# Altium project IOT_GRN_MAIN V1.0 A.PrjPcb (part 3 of 3)

## Sheet IOT_GRN_MAIN V1.0 A - OUTPUTS.SchDoc
size A4; SheetNumber: 4; SheetTotal: 4
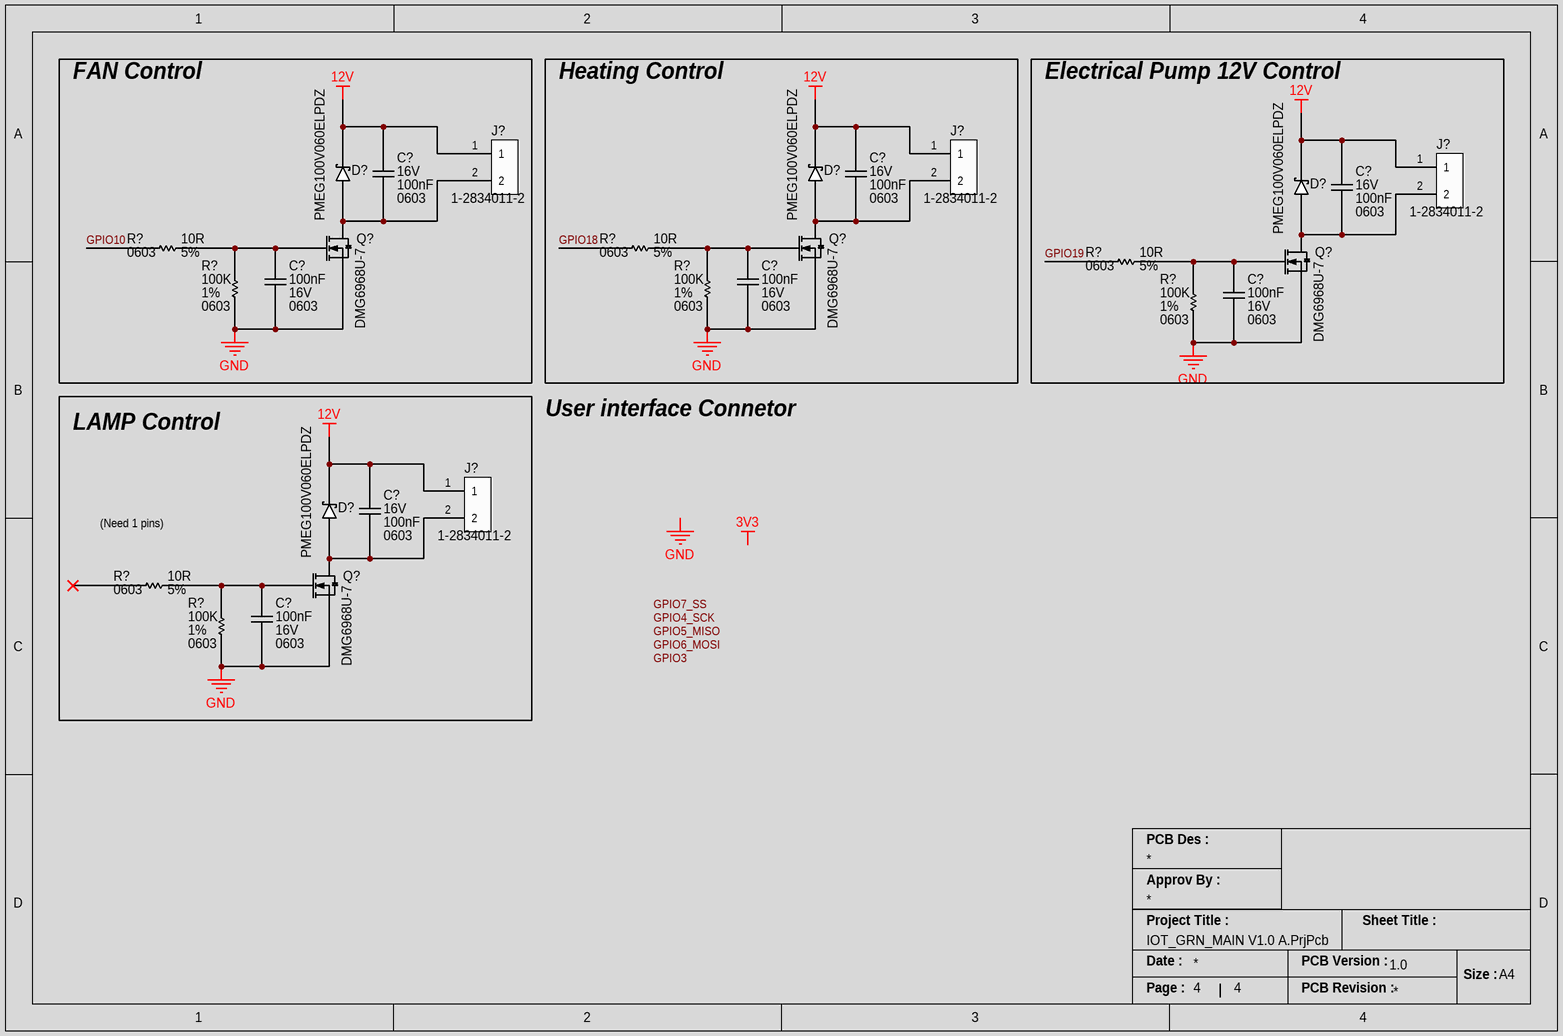
[diagram p3: IOT_GRN_MAIN V1.0 A - OUTPUTS.SchDoc]

### Parts
(Parts that share a designator on the sheet are numbered #1, #2 ... from top to bottom, then left to right.)
C?#9  Voltage: 16V  Capacitance: 100nF  Case/Package: 0603  [CAP_0603_CAPC1608X08N]  (hidden comment: CL10B104KO8NNNC)
C?#10  Voltage: 16V  Capacitance: 100nF  Case/Package: 0603  [CAP_0603_CAPC1608X08N]  (hidden comment: CL10B104KO8NNNC)
C?#11  Voltage: 16V  Capacitance: 100nF  Case/Package: 0603  [CAP_0603_CAPC1608X08N]  (hidden comment: CL10B104KO8NNNC)
C?#12  Voltage: 16V  Capacitance: 100nF  Case/Package: 0603  [CAP_0603_CAPC1608X08N]  (hidden comment: CL10B104KO8NNNC)
C?#13  Voltage: 16V  Capacitance: 100nF  Case/Package: 0603  [CAP_0603_CAPC1608X08N]  (hidden comment: CL10B104KO8NNNC)
C?#14  Voltage: 16V  Capacitance: 100nF  Case/Package: 0603  [CAP_0603_CAPC1608X08N]  (hidden comment: CL10B104KO8NNNC)
C?#15  Voltage: 16V  Capacitance: 100nF  Case/Package: 0603  [CAP_0603_CAPC1608X08N]  (hidden comment: CL10B104KO8NNNC)
C?#16  Voltage: 16V  Capacitance: 100nF  Case/Package: 0603  [CAP_0603_CAPC1608X08N]  (hidden comment: CL10B104KO8NNNC)
D?#5  PMEG100V060ELPDZ  [DIO_SCKTY_PMEG060V100EPDAZ]
D?#6  PMEG100V060ELPDZ  [DIO_SCKTY_PMEG060V100EPDAZ]
D?#7  PMEG100V060ELPDZ  [DIO_SCKTY_PMEG060V100EPDAZ]
D?#8  PMEG100V060ELPDZ  [DIO_SCKTY_PMEG060V100EPDAZ]
J?#4  1-2834011-2  [CONN_TBLOCK_128340112]
J?#5  1-2834011-2  [CONN_TBLOCK_128340112]
J?#6  1-2834011-2  [CONN_TBLOCK_128340112]
J?#7  1-2834011-2  [CONN_TBLOCK_128340112]
Q?#1  DMG6968U-7  [SOT_23_3_MMBT2907A-13]
Q?#2  DMG6968U-7  [SOT_23_3_MMBT2907A-13]
Q?#3  DMG6968U-7  [SOT_23_3_MMBT2907A-13]
Q?#4  DMG6968U-7  [SOT_23_3_MMBT2907A-13]
R?#2  Resistance: 10R  Tolerance: 5%  Case/Package: 0603  [RES_0603_RESC1608X04N]  (hidden comment: RC0603JR-0710RL)
R?#3  Resistance: 10R  Tolerance: 5%  Case/Package: 0603  [RES_0603_RESC1608X04N]  (hidden comment: RC0603JR-0710RL)
R?#4  Resistance: 10R  Tolerance: 5%  Case/Package: 0603  [RES_0603_RESC1608X04N]  (hidden comment: RC0603JR-0710RL)
R?#5  Resistance: 100K  Tolerance: 1%  Case/Package: 0603  [RES_0603_RESC1608X04N]  (hidden comment: RC0603FR-07100KL)
R?#6  Resistance: 100K  Tolerance: 1%  Case/Package: 0603  [RES_0603_RESC1608X04N]  (hidden comment: RC0603FR-07100KL)
R?#7  Resistance: 100K  Tolerance: 1%  Case/Package: 0603  [RES_0603_RESC1608X04N]  (hidden comment: RC0603FR-07100KL)
R?#8  Resistance: 10R  Tolerance: 5%  Case/Package: 0603  [RES_0603_RESC1608X04N]  (hidden comment: RC0603JR-0710RL)
R?#9  Resistance: 100K  Tolerance: 1%  Case/Package: 0603  [RES_0603_RESC1608X04N]  (hidden comment: RC0603FR-07100KL)

### Nets
12V: C?#9.2 C?#10.2 C?#11.2 C?#15.2 D?#5.K D?#6.K D?#7.K D?#8.K J?#4.1 J?#5.1 J?#6.1 J?#7.1
GND: C?#12.1 C?#13.1 C?#14.1 C?#16.1 Q?#1.S Q?#2.S Q?#3.S Q?#4.S R?#5.1 R?#6.1 R?#7.1 R?#9.1
GPIO10: R?#2.1
GPIO18: R?#3.1
GPIO19: R?#4.1
NetC?#9_1: C?#9.1 D?#5.A J?#4.2 Q?#1.D
NetC?#10_1: C?#10.1 D?#6.A J?#5.2 Q?#2.D
NetC?#11_1: C?#11.1 D?#7.A J?#6.2 Q?#3.D
NetC?#12_2: C?#12.2 Q?#1.G R?#2.2 R?#5.2
NetC?#13_2: C?#13.2 Q?#2.G R?#3.2 R?#6.2
NetC?#14_2: C?#14.2 Q?#3.G R?#4.2 R?#7.2
NetC?#15_1: C?#15.1 D?#8.A J?#7.2 Q?#4.D
NetC?#16_2: C?#16.2 Q?#4.G R?#8.2 R?#9.2

Not connected (* = marked no-connect by the designer): R?#8 1*

### Notes on the sheet
- FAN Control
- Heating Control
- Electrical Pump 12V Control
- LAMP Control
- User interface Connetor
- (Need 1 pins)
- Labels drawn without touching a wire or pin: 3V3, GND, GPIO3, GPIO4_SCK, GPIO5_MISO, GPIO6_MOSI, GPIO7_SS
- PCB Des :
- Approv By :
- Project Title :
- Sheet Title :
- Date :
- PCB Version :
- Size :
- A4
- Page :
- PCB Revision :

### Library data of the parts
C?#9-C?#16 = CAP_100NF_16V_X7R_0603: Ceramic capacitor SMD-0603 100nF /16V X7R# K +-10%, Samsung, RoHS; Dielectric: X7R; Tolerance: 10%; Manufacturer: Samsung; Manufacturer Part Number: CL10B104KO8NNNC; RoHS: Yes; Category: Ceramic Capacitors; Stock 1: 9799745; Pricing 1: 1=0.10000, 10=0.02700, 50=0.01500, 100=0.01220, 500=0.00874, 1000=0.00686 (USD); Mount: Surface Mount; Case Code (Metric): 1608; Case Code (Imperial): 0603; Material: Ceramic; Contact Plating: Tin; Min Operating Temperature: -55°C; Max Operating Temperature: 125°C; Packaging: Tape and Reel; Package Quantity: 1; Voltage Rating: 16V; Series: CL; Length: 1.6mm; Width: 0.031inch; Height: 0.8mm; Depth: 0.8mm; Thickness: 0.035inch; Radiation Hardening: No; Lead Free: Lead Free; RoHS Compliant: Yes; ComponentLink1URL: https://datasheet.ciiva.com/25805/cl10b104ko8nnnc-25805483.pdf?src-supplier=Digi-Key; ComponentLink1Description: https://datasheet.ciiva.com/25805/cl10b104ko8nnnc-25805483.pdf?src-supplier=Digi-Key; ComponentLink2URL: https://datasheet.ciiva.com/26838/getdatasheetpartid-357417-26838418.pdf?src-supplier=Verical; ComponentLink2Description: https://datasheet.ciiva.com/26838/getdatasheetpartid-357417-26838418.pdf?src-supplier=Verical; ComponentLink3URL: https://datasheet.ciiva.com/29198/456679-da-01-en-vs-kondensator-0603-29198846.pdf?src-supplier=Conrad; ComponentLink3Description: https://datasheet.ciiva.com/29198/456679-da-01-en-vs-kondensator-0603-29198846.pdf?src-supplier=Conrad; Supplier 1: Digi-Key; Supplier 2: Newark; Supplier 3: Mouser; Supplier Part Number 1: 1276-1005-1-ND; Supplier Part Number 2: 82AC9325; Supplier Part Number 3: 187-CL10B104KO8NNNC
D?#5-D?#8 = DIO_SCTKY_100V_6A_PMEG100V060ELPDZ: DIODESCHOTTKY100V6ACFP15; Manufacturer: Nexperia; Supplier 1: Digikey; Manufacturer Part Number: PMEG100V060ELPDZ; RoHS: Yes; Category: Schottky Diodes; Stock 1: 60422; Pricing 1: 1=0.58, 10=0.504, 100=0.3491, 500=0.29166 (USD); RoHS Compliant: Yes; ComponentLink1URL: http://www.farnell.com/datasheets/2341403.pdf?src-supplier=Farnell; ComponentLink1Description: http://www.farnell.com/datasheets/2341403.pdf?src-supplier=Farnell; ComponentLink2URL: https://datasheet.octopart.com/PMEG100V060ELPDZ-Nexperia-datasheet-87796136.pdf?src-supplier=Future+Electronics; ComponentLink2Description: https://datasheet.octopart.com/PMEG100V060ELPDZ-Nexperia-datasheet-87796136.pdf?src-supplier=Future+Electronics
J?#4-J?#7 = CONN_TBLOCK_2P_3.5mm_1-2834011-2: 2POS3.5MMTOPENTRYSCREWLESSC; Manufacturer: TE Connectivity; Current Rating: 6A; Voltage Rating: 300V; Connector Type: Receptacle,Connector; Number of Positions: 2; Sealable: No (Without); Number of Levels: 1; Wire/Cable Gauge: 14AWG; Wire Gauge (Max): 20AWG; Approvals: UL; Supplier 1: Digikey; Manufacturer Part Number: 1-2834011-2; RoHS: Yes; Category: Terminal Blocks; Stock 1: 110419; Pricing 1: 1=0.25, 10=0.209, 25=0.194, 50=0.1832, 100=0.1732, 250=0.16068, 500=0.15182, 1000=0.14552 (USD); Mount: Through Hole; Number of Pins: 2; Contact Plating: Tin,Lead; Color: Green; Housing Material: Nylon; Min Operating Temperature: -40°C; Max Operating Temperature: 105°C; Packaging: Box; Termination: Through Hole; Contact Current Rating: 6A; Series: -; Number of Positions Per Level: 2; Current: 6A; Voltage: 300V; Wire Gauge (Min): 14AWG; Lead Free: Lead Free; RoHS Compliant: Yes; Reach SVHC Compliant: Unknown; ComponentLink1URL: http://www.te.com/commerce/DocumentDelivery/DDEController?Action=srchrtrv&DocNm=1-1773872-7_ModularScrewlessTerminalBloc&DocType=DS&DocLang=English&src-supplier=Digikey; ComponentLink1Description: http://www.te.com/commerce/DocumentDelivery/DDEController?Action=srchrtrv&DocNm=1-1773872-7_ModularScrewlessTerminalBloc&DocType=DS&DocLang=English&src-supplier=Digikey; ComponentLink2URL: https://datasheet.octopart.com/1-2834011-2-TE-Connectivity-datasheet-62069794.pdf?src-supplier=Farnell; ComponentLink2Description: https://datasheet.octopart.com/1-2834011-2-TE-Connectivity-datasheet-62069794.pdf?src-supplier=Farnell; ComponentLink3URL: http://www.farnell.com/datasheets/2296738.pdf?src-supplier=Newark; ComponentLink3Description: http://www.farnell.com/datasheets/2296738.pdf?src-supplier=Newark; ComponentLink4URL: https://datasheet.octopart.com/1-2834011-2-TE-Connectivity-datasheet-77874288.pdf?src-supplier=Element14; ComponentLink4Description: https://datasheet.octopart.com/1-2834011-2-TE-Connectivity-datasheet-77874288.pdf?src-supplier=Element14; Supplier Part Number 1: A123848-ND
Q?#1-Q?#4 = TRANS_FET_CH_N_20V_6.5A_DMG6968U-7: Trans Mosfet N-ch 20V 6.5A 3-PIN SOT-23 T/r Trans Mosfet N-ch 20V 6.5A 3-PIN SOT-23 T/r; Manufacturer: Diodes; Rise Time: 66ns; Turn-Off Delay Time: 613ns; Turn-On Delay Time: 54ns; Fall Time: 205ns; Gate to Source Voltage (Vgs): 12V; Polarity: N-CHANNEL; Nominal Vgs: 500mV; Input Capacitance: 151pF; Max Power Dissipation: 1.3W; Rds On Max: 25mR; Number of Channels: 1; Drain-source On Resistance-Max: 36mR; Supplier 1: Digikey; Manufacturer Part Number: DMG6968U-7; RoHS: Yes; Category: MOSFETs; Stock 1: 575891; Pricing 1: 1=0.37, 10=0.289, 100=0.1732, 500=0.16034, 1000=0.10903 (USD); Mount: Surface Mount; Case/Package: SOT-23-3; Number of Pins: 3; Weight: 0.000282oz; Min Operating Temperature: -55°C; Max Operating Temperature: 150°C; Packaging: Tape and Reel; Package Quantity: 1; Continuous Drain Current (ID): 6.5A; Series: -; Drain to Source Voltage (Vdss): 20V; Drain to Source Resistance: 25mR; Threshold Voltage: 500mV; Length: 2.9mm; Width: 1.3mm; Height: 1mm; Radiation Hardening: No; Reach SVHC Compliant: No; Lead Free: Lead Free; RoHS Compliant: Yes; ComponentLink1URL: https://datasheet.ciiva.com/5774/ds31738-5774992.pdf?src-supplier=Farnell; ComponentLink1Description: https://datasheet.ciiva.com/5774/ds31738-5774992.pdf?src-supplier=Farnell; ComponentLink2URL: https://datasheet.ciiva.com/22712/1915638-22712395.pdf?src-supplier=Element14; ComponentLink2Description: https://datasheet.ciiva.com/22712/1915638-22712395.pdf?src-supplier=Element14; Supplier Part Number 1: DMG6968UDICT-ND
R?#2-R?#4 R?#8 = RES_10R_5%_100mW_0603: SMD Chip Resistor, 10 Ohm, ± 5%, 100 mW, 0603 [1608 Metric], Thick Film, General Purpose; Manufacturer: Yageo; Temperature Coefficient: 200ppm/°C; Voltage Rating (DC): 50V; Power Rating: 100mW; Supplier 1: Digi-Key; Manufacturer Part Number: RC0603JR-0710RL; RoHS: Yes; Category: Chip SMD Resistors; Stock 1: 769777; Pricing 1: 1=0.1, 10=0.024, 50=0.0154, 100=0.013, 500=0.00894, 1000=0.00773 (USD); Number of Pins: 2; Case Code (Imperial): 0603; Case Code (Metric): 1608; Size Code: 0603; Min Operating Temperature: -55°C; Max Operating Temperature: 155°C; Resistor Type: Thick Film; Packaging: Tape and Reel; Voltage Rating: 50V; Termination: SMD/SMT; Features: Moisture Resistant; Series: RC; Max Power Dissipation: 100mW; Number of Terminations: 2; Construction: Rectangular; Resistance Tolerance: 5%; Length: 1.6mm; Width: 0.8mm; Depth: 0.8mm; Reach SVHC Compliant: No; Lead Free: Lead Free; Military Standard: Not; RoHS Compliant: Yes; ComponentLink1URL: https://datasheet.ciiva.com/46395/443971-46395069.pdf?src-supplier=Element14; ComponentLink1Description: https://datasheet.ciiva.com/46395/443971-46395069.pdf?src-supplier=Element14; ComponentLink2URL: https://datasheet.ciiva.com/7746/443971-7746431.pdf?src-supplier=Element14; ComponentLink2Description: https://datasheet.ciiva.com/7746/443971-7746431.pdf?src-supplier=Element14; Supplier Part Number 1: 311-10GRCT-ND
R?#5-R?#7 R?#9 = RES_100K_1%_100mW_0603: RES SMD 100K OHM 1% 1/10W 0603; Manufacturer: Yageo; Temperature Coefficient: 100ppm/°C; Power Rating: 100mW; Voltage Rating: 50V; Working Voltage: 75V; Supplier 1: Digi-Key; Manufacturer Part Number: RC0603FR-07100KL; RoHS: Yes; Category: Chip SMD Resistors; Stock 1: 11038732; Pricing 1: 1=0.10000, 10=0.01900, 100=0.00770, 1000=0.00345, 2500=0.00300 (USD); Number of Pins: 2; Case Code (Imperial): 0603; Case Code (Metric): 1608; Min Operating Temperature: -55°C; Max Operating Temperature: 155°C; Resistor Type: Thick Film; Voltage Rating (DC): 50V; Packaging: Tape and Reel; Termination: SMD/SMT; Number of Terminations: 2; Features: Moisture Resistant; Series: RC; Max Power Dissipation: 100mW; Resistance Tolerance: 1%; Construction: Rectangular; Technology: THICK FILM; Length: 1.6mm; Width: 0.8mm; Height: 0.45mm; Depth: 0.8mm; Reach SVHC Compliant: Yes; Military Standard: Not; Lead Free: Lead Free; RoHS Compliant: Yes; ComponentLink1URL: https://datasheet.ciiva.com/11808/0900766b80f96399-11808107.pdf?src-supplier=Rs; ComponentLink1Description: https://datasheet.ciiva.com/11808/0900766b80f96399-11808107.pdf?src-supplier=Rs; ComponentLink2URL: https://datasheet.ciiva.com/7983/443971-7983593.pdf?src-supplier=Element14; ComponentLink2Description: https://datasheet.ciiva.com/7983/443971-7983593.pdf?src-supplier=Element14; ComponentLink3URL: https://datasheet.ciiva.com/22747/443971-22747516.pdf?src-supplier=Element14; ComponentLink3Description: https://datasheet.ciiva.com/22747/443971-22747516.pdf?src-supplier=Element14; ComponentLink4URL: https://datasheet.ciiva.com/46440/1868787-46440889.pdf?src-supplier=Element14; ComponentLink4Description: https://datasheet.ciiva.com/46440/1868787-46440889.pdf?src-supplier=Element14; ComponentLink5URL: https://datasheet.ciiva.com/7746/1738695-7746235.pdf?src-supplier=Element14; ComponentLink5Description: https://datasheet.ciiva.com/7746/1738695-7746235.pdf?src-supplier=Element14; ComponentLink6URL: https://datasheet.ciiva.com/7746/1738695-7746234.pdf?src-supplier=Element14; ComponentLink6Description: https://datasheet.ciiva.com/7746/1738695-7746234.pdf?src-supplier=Element14; Supplier Part Number 1: 311-100KHRDKR-ND

## Nets that join several sheets
3V3: IOT_GRN_MAIN V1.0 A - PWR INPUT (5 pins), IOT_GRN_MAIN V1.0 A - ESP32 (9 pins), IOT_GRN_MAIN V1.0 A - INPUTS (8 pins)
5V: IOT_GRN_MAIN V1.0 A - PWR INPUT (8 pins), IOT_GRN_MAIN V1.0 A - ESP32 (C3.2 D1.1 D6.3)
12V: IOT_GRN_MAIN V1.0 A - PWR INPUT (6 pins), IOT_GRN_MAIN V1.0 A - OUTPUTS (12 pins)
GND: IOT_GRN_MAIN V1.0 A - PWR INPUT (18 pins), IOT_GRN_MAIN V1.0 A - ESP32 (55 pins), IOT_GRN_MAIN V1.0 A - INPUTS (14 pins), IOT_GRN_MAIN V1.0 A - OUTPUTS (12 pins)
GPIO0_ADC1_0: IOT_GRN_MAIN V1.0 A - ESP32 (J4.1 U1.12), IOT_GRN_MAIN V1.0 A - INPUTS (U4.1 U4.4)
GPIO1_ADC1_1: IOT_GRN_MAIN V1.0 A - ESP32 (J4.2 U1.13), IOT_GRN_MAIN V1.0 A - INPUTS (U5.1 U5.4)
GPIO2_ADC1_2: IOT_GRN_MAIN V1.0 A - ESP32 (J4.3 U1.5), IOT_GRN_MAIN V1.0 A - INPUTS (U6.1 U6.4)
GPIO8_SDA: IOT_GRN_MAIN V1.0 A - ESP32 (J4.9 R6.2 R15.2 U1.22), IOT_GRN_MAIN V1.0 A - INPUTS (J5.4)
GPIO9_SCL: IOT_GRN_MAIN V1.0 A - ESP32 (6 pins), IOT_GRN_MAIN V1.0 A - INPUTS (J5.3)
GPIO10: IOT_GRN_MAIN V1.0 A - ESP32 (J4.11 U1.16), IOT_GRN_MAIN V1.0 A - OUTPUTS (R?#2.1)
GPIO18: IOT_GRN_MAIN V1.0 A - ESP32 (J4.12 U1.26), IOT_GRN_MAIN V1.0 A - OUTPUTS (R?#3.1)
GPIO19: IOT_GRN_MAIN V1.0 A - ESP32 (J4.13 U1.27), IOT_GRN_MAIN V1.0 A - OUTPUTS (R?#4.1)

## Assembly variants
Base Variant: not fitted C? C? D? J? J? J? Q? R8 R? R? R? R? U7 U?